# Altium schematic sheet 470uF.schdoc
size 46 x 30 mm
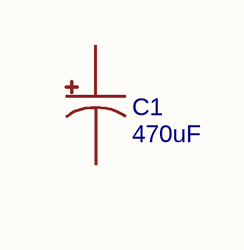
[diagram p0: 470uF.schdoc]

## Parts
C1  470uF  [CAP-SMD_BD12.5-L13.0-W13.0-RD]

## Nets

Not connected (* = marked no-connect by the designer): C1 1 2

## Library data of the parts
C1 = 470uF: BOM_Manufacturer: ROQANG; BOM_Manufacturer Part: RVT1H471M1213; nameAlias: Capacitance; BOM_Supplier: LCSC; BOM_Supplier Part: C90272; BOM_JLCPCB Part Class: Extended Part; spicePre: C; spiceSymbolName: RVT1H471M1213